# EAGLE design SensorBoard (EAGLE 6.6.0)
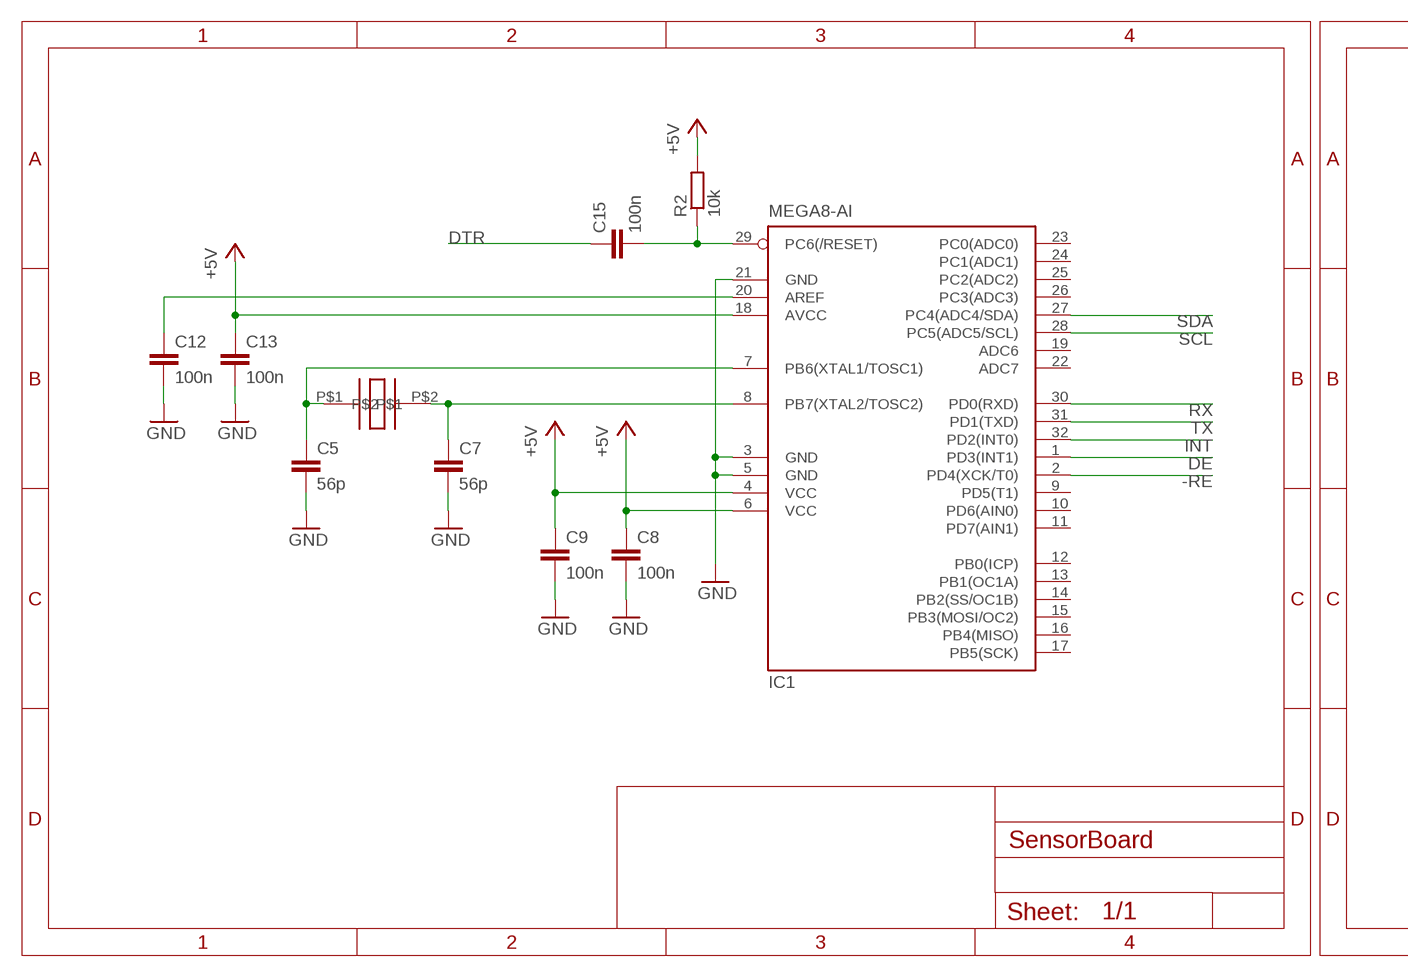
[diagram p0: schematic, sheet 1, part 1 of 2]
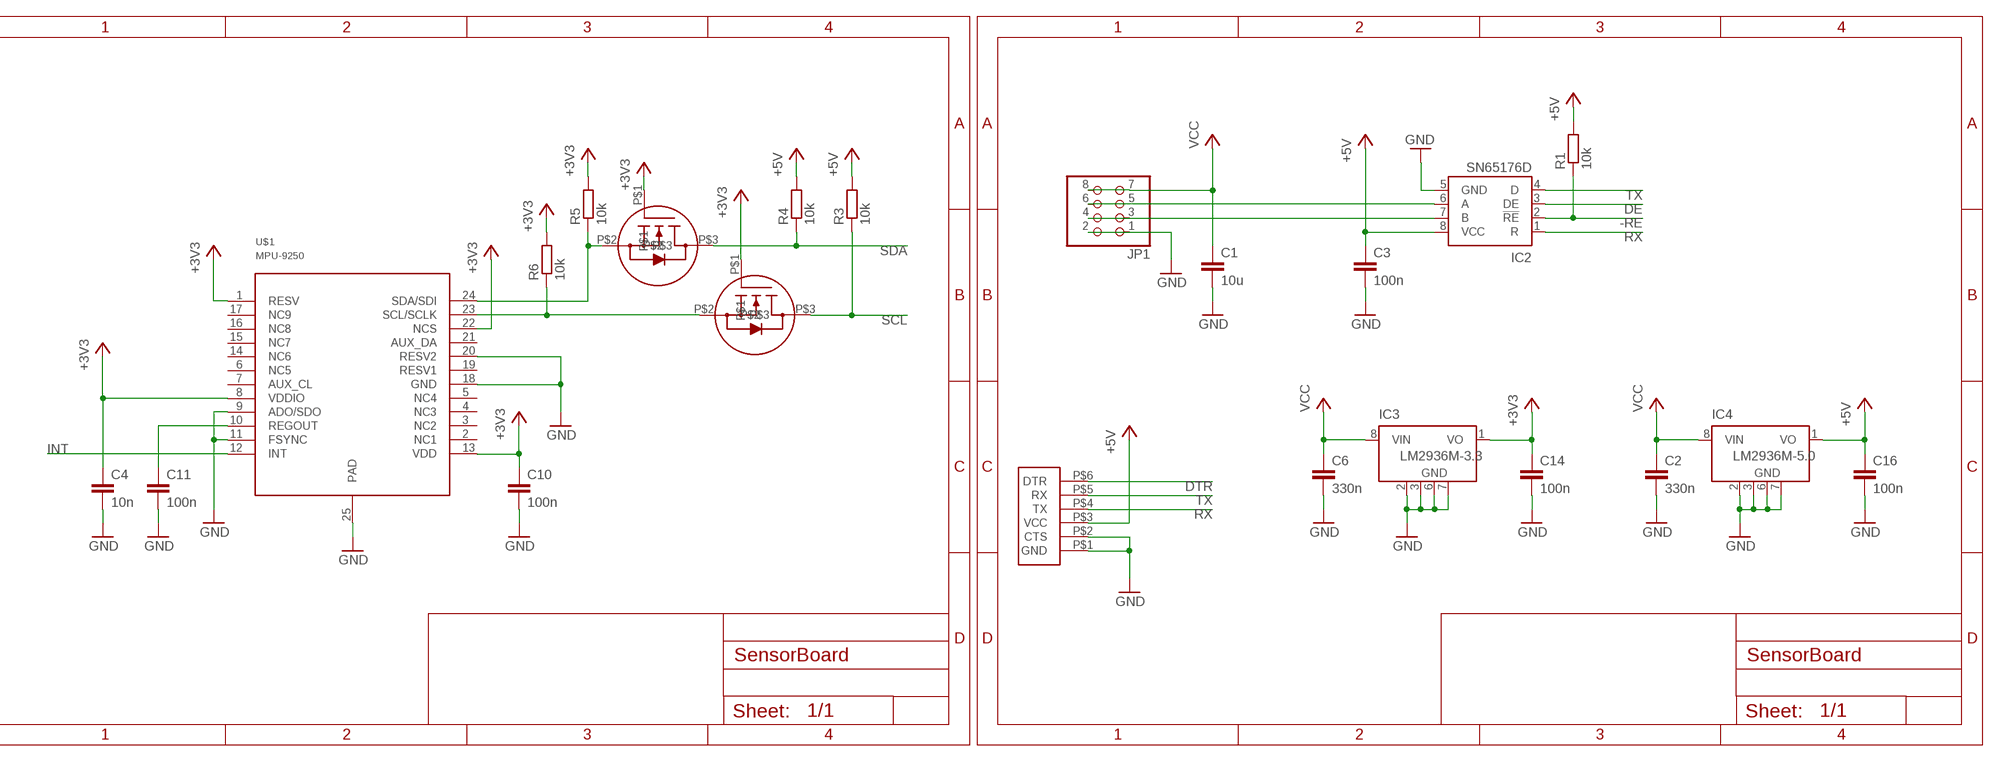
[diagram p1: schematic, sheet 1, part 2 of 2]

## Parts
C1  10u  C-EUC0805  [C0805]
C2  330n  C-EUC0603  [C0603]
C3  100n  C-EUC0603  [C0603]
C4  10n  C-EUC0603  [C0603]
C5  56p  C-EUC0603  [C0603]
C6  330n  C-EUC0603  [C0603]
C7  56p  C-EUC0603  [C0603]
C8  100n  C-EUC0603  [C0603]
C9  100n  C-EUC0603  [C0603]
C10  100n  C-EUC0603  [C0603]
C11  100n  C-EUC0603  [C0603]
C12  100n  C-EUC0603  [C0603]
C13  100n  C-EUC0603  [C0603]
C14  100n  C-EUC0603  [C0603]
C15  100n  C-EUC0603  [C0603]
C16  100n  C-EUC0603  [C0603]
IC1  MEGA8-AI  [TQFP32-08]
IC2  SN65176D  [SO-08]
IC3  LM2936M-3.3  [SO08]
IC4  LM2936M-5.0  [SO08]
JP1  PINHD-2X4/90  [2X04/90]
R1  10k  R-EU_R0603  [R0603]
R2  10k  R-EU_R0603  [R0603]
R3  10k  R-EU_R0603  [R0603]
R4  10k  R-EU_R0603  [R0603]
R5  10k  R-EU_R0603  [R0603]
R6  10k  R-EU_R0603  [R0603]
U$1  MPU-9250  [LEAD-QFN24]
U$2  2N7002E  [SOT-23-3]
U$3  2N7002E  [SOT-23-3]
U$4  LFXTAL003240BULK  [LFXTAL003240BULK]
U$5  FTDI-PINHEADER  [FTDI-PINHEADER]

## Nets
+3V3: C4.1 C10.1 C14.1 IC3.1(VO) R5.2 R6.2 U$1.1(RESV) U$1.8(VDDIO) U$1.13(VDD) U$1.22(NCS) U$2.P$1 U$3.P$1
+5V: C3.1 C8.1 C9.1 C13.1 C16.1 IC1.4(VCC) IC1.6(VCC) IC1.18(AVCC) IC2.8(VCC) IC4.1(VO) R1.2 R2.2 R3.2 R4.2 U$5.P$3(VCC)
-RE: IC1.2(PD4(XCK/T0)) IC2.2(!RE) R1.1
DE: IC1.1(PD3(INT1)) IC2.3(DE)
DTR: C15.1 U$5.P$6(DTR)
GND: C1.2 C2.2 C3.2 C4.2 C5.2 C6.2 C7.2 C8.2 C9.2 C10.2 C11.2 C12.2 C13.2 C14.2 C16.2 IC1.3(GND) IC1.5(GND) IC1.21(GND) IC2.5(GND) IC3.2(GND) IC3.3(GND) IC3.6(GND) IC3.7(GND) IC4.2(GND) IC4.3(GND) IC4.6(GND) IC4.7(GND) JP1.1 JP1.2 U$1.9(ADO/SDO) U$1.11(FSYNC) U$1.18(GND) U$1.20(RESV2) U$1.25(PAD) U$5.P$1(GND) U$5.P$2(CTS)
INT: IC1.32(PD2(INT0)) U$1.12(INT)
N$1: IC2.6(A) JP1.5 JP1.6
N$2: IC2.7(B) JP1.3 JP1.4
N$3: R6.1 U$1.23(SCL/SCLK) U$2.P$2
N$4: C11.1 U$1.10(REGOUT)
N$5: C5.1 IC1.7(PB6(XTAL1/TOSC1)) U$4.P$1
N$6: R5.1 U$1.24(SDA/SDI) U$3.P$2
N$7: C7.1 IC1.8(PB7(XTAL2/TOSC2)) U$4.P$2
N$8: C15.2 IC1.29(PC6(/RESET)) R2.1
N$9: C12.1 IC1.20(AREF)
RX: IC1.30(PD0(RXD)) IC2.1(R) U$5.P$4(TX)
SCL: IC1.28(PC5(ADC5/SCL)) R3.1 U$2.P$3
SDA: IC1.27(PC4(ADC4/SDA)) R4.1 U$3.P$3
TX: IC1.31(PD1(TXD)) IC2.4(D) U$5.P$5(RX)
VCC: C1.1 C2.1 C6.1 IC3.8(VIN) IC4.8(VIN) JP1.7 JP1.8
Unconnected: IC1.9(PD5(T1)) IC1.10(PD6(AIN0)) IC1.11(PD7(AIN1)) IC1.12(PB0(ICP)) IC1.13(PB1(OC1A)) IC1.14(PB2(SS/OC1B)) IC1.15(PB3(MOSI/OC2)) IC1.16(PB4(MISO)) IC1.17(PB5(SCK)) IC1.19(ADC6) IC1.22(ADC7) IC1.23(PC0(ADC0)) IC1.24(PC1(ADC1)) IC1.25(PC2(ADC2)) IC1.26(PC3(ADC3)) U$1.2(NC1) U$1.3(NC2) U$1.4(NC3) U$1.5(NC4) U$1.6(NC5) U$1.7(AUX_CL) U$1.14(NC6) U$1.15(NC7) U$1.16(NC8) U$1.17(NC9) U$1.19(RESV1) U$1.21(AUX_DA)

## Library data of the parts
C1-C16 = resistor:C-EU: CAPACITOR, European symbol
IC1 = atmel:MEGA8: MICROCONTROLLER 8 Kbytes FLASH, 1 kbytes SRAM, 512 bytes EEPROM, USART, 6-channel 10 bit ADC, 2-channel 8 bit ADC Pin compatible with Atmega48, ATMega88, ATMega168 Source: avr.lbr; MPN: ATMEGA8-16AU; OC_FARNELL: 9171371; OC_NEWARK: 73M8863
IC2 = texas:SN65176: DIFFERENTIAL BUS TRANSCEIVER Source: http://focus.ti.com .. sn65176b.pdf; MF: TEXAS INSTRUMENTS; MPN: SN65176BD; OC_FARNELL: 9589970; OC_NEWARK: 08F5891
IC3 = national-semiconductor:LM2936M?*: Ultra-Low Quiescent Current LDO Voltage Regulator Source: Data sheet <http://www.national.com/ds/LM/LM2936.pdf>; MF: NATIONAL SEMICONDUCTOR; MPN: LM2936M-3.3/NOPB; OC_FARNELL: 1469059; OC_NEWARK: 41K4514
IC4 = national-semiconductor:LM2936M?*: Ultra-Low Quiescent Current LDO Voltage Regulator Source: Data sheet <http://www.national.com/ds/LM/LM2936.pdf>; MF: NATIONAL SEMICONDUCTOR; MPN: LM2936M-5.0/NOPB; OC_FARNELL: 9494421; OC_NEWARK: 41K4515
JP1 = pinhead:PINHD-2X4: PIN HEADER
R1-R6 = resistor:R-EU_: RESISTOR, European symbol
U$1 = invensense:MPU-9250
U$2 U$3 = 2N7002E:2N7002E
U$4 = LFXTAL003240Bulk:LFXTAL003240BULK
U$5 = FTDI-PINHEADER:FTDI-PINHEADER

## Board
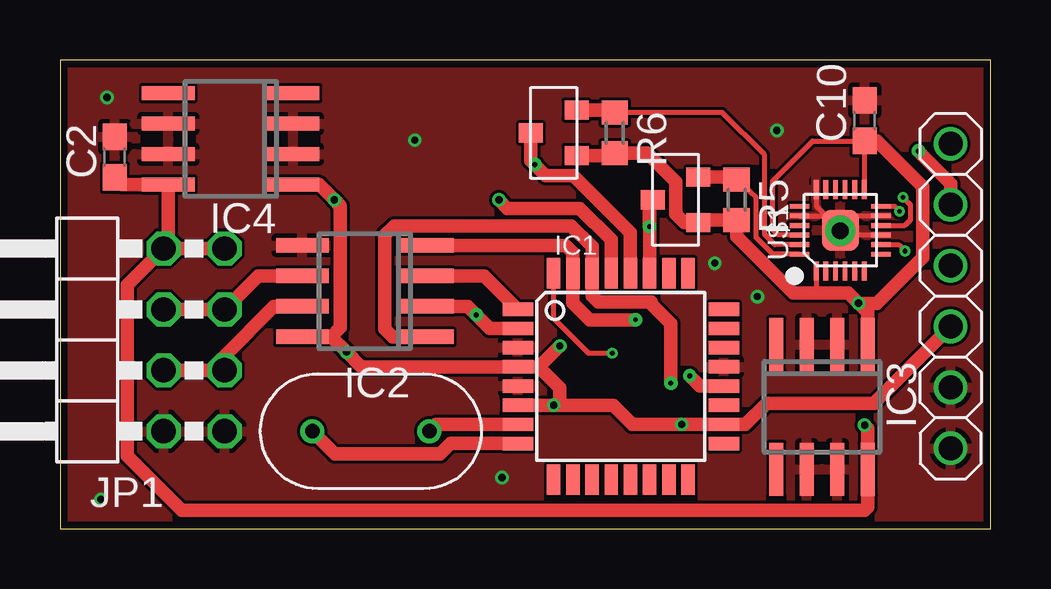
[diagram p2: board, top side]
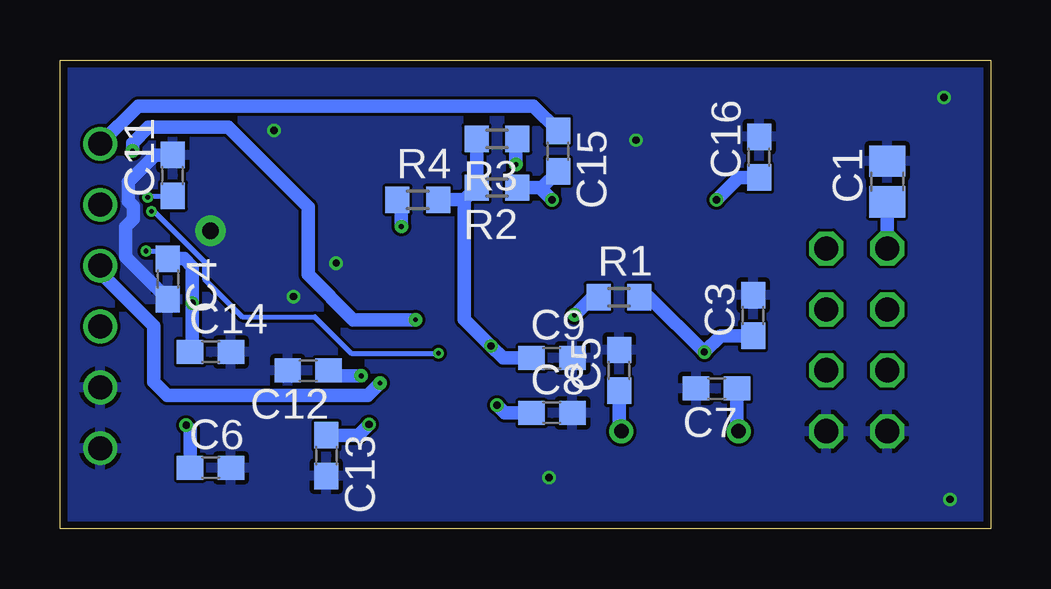
[diagram p3: board, bottom side, seen from below]

Size 38.79 x 19.55 mm. Coordinates in mm from the lower left corner, seen from the top.
Outline: 0,0 38.79,0 38.79,19.55 0,19.55 0,0
Copper layers (1*16): Top 0.035mm / dielectric 1.5mm / Bottom 0.035mm
Design rules "PCB-POOL HighSpec": minimum track width 0.125mm, minimum drill 0.2mm, track to track 0.125mm, track to pad 0.125mm, pad to pad 0.125mm, via to via 0.125mm, smd to smd 0.125mm, copper to edge 0.3mm, drill to drill 0.2mm, minimum pad ring 0.2mm, minimum via ring 0.125mm, stop-mask expansion 0.075mm, vias tented up to drill 0mil, thermal gap 0.2mm

### Footprints (pad centres in the part's own frame; a part is rotated, then mirrored left to right if it is on the bottom)
C0805 = smd 1.3 x 1.5: 1 -0.85,0; 2 0.85,0
C0603 = smd 1.1 x 1: 1 -0.85,0; 2 0.85,0
TQFP32-08 = smd 1.27 x 0.559: 1 -4.293,2.8; 2 -4.293,2; 3 -4.293,1.2; 4 -4.293,0.4; 5 -4.293,-0.4; 6 -4.293,-1.2; 7 -4.293,-2; 8 -4.293,-2.8; 17 4.293,-2.8; 18 4.293,-2; 19 4.293,-1.2; 20 4.293,-0.4; 21 4.293,0.4; 22 4.293,1.2; 23 4.293,2; 24 4.293,2.8 | smd 0.559 x 1.27: 9 -2.8,-4.293; 10 -2,-4.293; 11 -1.2,-4.293; 12 -0.4,-4.293; 13 0.4,-4.293; 14 1.2,-4.293; 15 2,-4.293; 16 2.8,-4.293; 25 2.8,4.293; 26 2,4.293; 27 1.2,4.293; 28 0.4,4.293; 29 -0.4,4.293; 30 -1.2,4.293; 31 -2,4.293; 32 -2.8,4.293
SO-08 = smd 0.6 x 2.2: 1 -1.905,-2.6; 2 -0.635,-2.6; 3 0.635,-2.6; 4 1.905,-2.6; 5 1.905,2.6; 6 0.635,2.6; 7 -0.635,2.6; 8 -1.905,2.6
SO08 = smd 0.6 x 2.2: 1 -1.905,-2.6; 2 -0.635,-2.6; 3 0.635,-2.6; 4 1.905,-2.6; 5 1.905,2.6; 6 0.635,2.6; 7 -0.635,2.6; 8 -1.905,2.6
2X04/90 = drill 1.016 octagon: 1 -3.81,-6.35; 2 -3.81,-3.81; 3 -1.27,-6.35; 4 -1.27,-3.81; 5 1.27,-6.35; 6 1.27,-3.81; 7 3.81,-6.35; 8 3.81,-3.81
R0603 = smd 1 x 1.1: 1 -0.85,0; 2 0.85,0
LEAD-QFN24 = smd 0.8 x 0.2: 1 -1.7,1; 2 -1.7,0.6; 3 -1.7,0.2; 4 -1.7,-0.2; 5 -1.7,-0.6; 6 -1.7,-1; 13 1.7,-1; 14 1.7,-0.6; 15 1.7,-0.2; 16 1.7,0.2; 17 1.7,0.6; 18 1.7,1 | smd 0.2 x 0.8: 7 -1,-1.7; 8 -0.6,-1.7; 9 -0.2,-1.7; 10 0.2,-1.7; 11 0.6,-1.7; 12 1,-1.7; 19 1,1.7; 20 0.6,1.7; 21 0.2,1.7; 22 -0.2,1.7; 23 -0.6,1.7; 24 -1,1.7 | smd 1.7 x 1.54: 25 0,0
SOT-23-3 = smd 0.8 x 1: P$1 -0.95,-0.95; P$2 0.95,-0.95; P$3 0,0.95
LFXTAL003240BULK = drill 0.6: P$1 -2.44,0; P$2 2.44,0
FTDI-PINHEADER = drill 1: P$1 0,-6.35; P$2 0,-3.81; P$3 0,-1.27; P$4 0,1.27; P$5 0,3.81; P$6 0,6.35

### Placement (x,y rotation side)
C1  4.32,14.48 90 bottom
C2  2.29,15.49 90 top
C3  9.91,8.89 90 bottom
C4  34.29,10.41 270 bottom
C5  15.49,6.6 90 bottom
C6  32.51,2.54 0 bottom
C7  11.43,5.84 180 bottom
C8  18.29,4.83 0 bottom
C9  18.29,7.11 0 bottom
C10  33.53,17.02 90 top
C11  34.09,14.73 90 bottom
C12  28.45,6.6 180 bottom
C13  27.69,3.05 270 bottom
C14  32.51,7.37 0 bottom
C15  18.03,15.75 270 bottom
C16  9.65,15.49 90 bottom
IC1  23.37,6.35 0 top
IC2  12.7,9.91 90 top
IC3  31.75,5.08 180 top
IC4  7.11,16.26 90 top
JP1  0.51,7.87 90 top
R1  15.49,9.65 0 bottom
R2  20.57,14.22 180 bottom
R3  20.57,16.26 180 bottom
R4  23.88,13.72 0 bottom
R5  28.19,13.72 270 top
R6  23.11,16.51 270 top
U$1  32.51,12.45 90 top
U$2  20.57,16.51 90 top
U$3  25.65,13.72 90 top
U$4  12.95,4.06 180 top
U$5  37.11,9.7 0 top

### Tracks (layer width: path | path; a pad name or v marks a point on that pad's centre or on a via)
+3V3  (via drill 0.2 pad 0.2, 0.3 pad 0.56)
  Top 0.2: 30.17,12.25 U$1.22 29.92,12.25 29.69,12.47 29.69,14.5 31.36,16.17 C10.1 33.51,16.15 U$1.13 | U$1.8 34.94,11.85 v35.2,11.58 | U$1.1 31.51,9.99 31.67,9.83
  Top 0.559: U$2.P$1 23.01,15.56 R6.2 24.47,15.66 25.65,14.48 25.65,13.12 26.01,12.77 U$3.P$1 26.7,12.87 R5.2 28.19,12.19 30.56,9.83 31.67,9.83 32.84,9.83 v33.27,9.4 | v33.27,9.4 33.66,9.02 IC3.1 | v33.27,9.4 34.04,9.4 35.94,11.3 35.94,14.28 34.05,16.17 C10.1
  Bottom 0.2: v35.2,11.58 34.61,11.58 C4.1
  Bottom 0.559: C14.1 33.27,7.45 v33.27,9.4 33.27,10.92 33.62,11.26 C4.1
+5V  (via drill 0.3 pad 0.56)
  Top 0.559: 11.3,8 v11.94,7.37 12.55,6.75 IC1.4 19.96,6.75 | 19.96,6.75 v20.83,7.62 | 19.96,6.75 20.83,5.88 20.83,5.33 20.64,5.15 IC1.6 v20.57,5.15 23.04,5.15 23.84,4.35 v25.91,4.35 IC1.18 28.56,4.35 29.44,5.23 33.91,5.23 U$5.P$3 | 11.3,8 11.68,8.38 11.68,13.46 v11.43,13.72 10.79,14.35 IC4.1 | 11.3,8 IC2.8
  Bottom 0.559: R4.2 21.93,13.72 | 21.93,13.72 R2.2 R3.2 | 21.93,13.72 21.93,8.72 v20.83,7.62 20.32,7.11 C9.1 | C3.1 11.26,8.04 v11.94,7.37 14.22,9.65 R1.2 | C8.1 20.25,4.83 v20.57,5.15 | C13.1 26.36,3.9 v25.91,4.35 | C16.1 10.5,14.64 v11.43,13.72
-RE  (via drill 0.2 pad 0.56)
  Top 0.559: IC2.2 16.99,9.27 v17.35,8.91 17.91,8.35 IC1.2
  Bottom 0.559: R1.1 16.61,9.65 v17.35,8.91
DE
  Top 0.559: IC2.3 17.68,10.54 IC1.1
DTR
  Bottom 0.559: C15.1 19.06,17.63 35.53,17.63 U$5.P$6
GND  (via drill 0.3 pad 0.56, 0.7 pad 0.2)
  Top 0.2: U$1.18 31.51,13.45 U$1.25 | U$1.20 31.91,13.05 U$1.25 | U$1.11 33.11,13.05 U$1.25 | U$1.9 32.71,12.25 U$1.25
  Bottom 0.559: C4.2 34.29,9.58 36.04,11.33 36.04,12.6 35.74,12.9 35.74,13.46 35.94,13.66 35.94,14.45 34.81,15.58 C11.2
  other vias: 29.06,9.68 27.28,11.07 18.41,2.13 14.78,16.21 29.87,16.61 1.7,1.22 1.96,17.98 32.51,12.42
  pour Bottom: 40.64,-1.27 -1.27,-1.27 -1.27,20.32 40.64,20.32
  pour Top: -2.54,21.59 -2.54,-2.54 41.91,-2.54 41.91,21.59
INT  (via drill 0.2 pad 0.2)
  Top 0.2: v23.01,7.32 22.02,7.32 20.57,8.77 IC1.32 | U$1.12 34.76,13.45 v34.98,13.23
  Bottom 0.2: v23.01,7.32 26.64,7.32 28.17,8.84 31.19,8.84 32.77,10.41 32.77,11.15 34.85,13.23 v34.98,13.23
N$1
  Top 0.559: JP1.6 JP1.5 8.26,10.54 IC2.6
N$2
  Top 0.559: JP1.4 JP1.3 6.86,7.21 8.91,9.27 IC2.7
N$3
  Top 0.2: U$1.23 29.79,11.85 29.36,12.27 29.36,15.6 27.6,17.36 R6.1
  Top 0.559: U$2.P$2 23.01,17.46 R6.1
N$4  (via drill 0.2 pad 0.2)
  Top 0.2: U$1.10 35.2,12.65 35.43,12.88 35.43,13.51 v35.13,13.82
  Bottom 0.2: C11.1 34.33,13.84 35.1,13.84 v35.13,13.82
N$5
  Top 0.559: IC1.7 15.68,4.35 U$4.P$1
  Bottom 0.559: C5.1 15.49,4.16 U$4.P$1
N$6
  Top 0.2: U$1.24 29.7,11.45 29.01,12.14 29.01,13.82 R5.1
  Top 0.559: U$3.P$2 28.09,14.67 R5.1
N$7
  Top 0.559: IC1.8 16.27,3.55 15.85,3.12 11.45,3.12 U$4.P$2
  Bottom 0.559: C7.1 10.58,4.13 U$4.P$2
N$8  (via drill 0.3 pad 0.56)
  Top 0.559: IC1.29 22.97,12.06 21.67,13.36 18.64,13.36 v18.29,13.72
  Bottom 0.559: R2.1 18.8,14.22 | 18.8,14.22 18.71,14.22 C15.2 | v18.29,13.72 18.8,14.22
N$9  (via drill 0.2 pad 0.56)
  Top 0.559: IC1.20 26.66,5.95 v26.24,6.38
  Bottom 0.559: v26.24,6.38 27.57,6.38 C12.1
RX  (via drill 0.2 pad 0.56)
  Top 0.559: IC2.1 13.87,8 13.54,8.33 13.54,12.24 13.92,12.62 21.31,12.62 22.17,11.77 IC1.30 22.17,9.71 22.43,9.45 24.56,9.45 | 24.56,9.45 24.64,9.45 | v25.45,6.07 25.45,8.56 24.56,9.45
  Bottom 0.559: v25.45,6.07 25.96,5.56 34.31,5.56 34.87,6.12 34.87,8.46 37.11,10.69 U$5.P$4
SCL  (via drill 0.2 pad 0.56)
  Top 0.559: IC1.28 23.77,12.35 21.39,14.73 20.24,14.73 v19.79,15.19 19.62,15.35 U$2.P$3
  Bottom 0.559: v19.79,15.19 19.79,16.19 R3.1
SDA  (via drill 0.2 pad 0.56)
  Top 0.559: IC1.27 24.57,13.58 U$3.P$3 24.56,13.57 v24.56,12.6
  Bottom 0.559: v24.56,12.6 24.56,13.55 R4.1
TX  (via drill 0.2 pad 0.56)
  Top 0.559: IC2.4 21.08,11.81 21.37,11.53 IC1.31 21.37,9.42 22.07,8.71 v23.98,8.71 | U$5.P$5 37.11,14.4 v35.76,15.75
  Bottom 0.559: v35.76,15.75 35.76,16.08 35.1,16.74 31.77,16.74 28.45,13.41 28.45,10.59 26.57,8.71 v23.98,8.71
VCC  (via drill 0.3 pad 0.56)
  Top 0.559: v33.53,4.32 33.66,4.19 IC3.8 33.66,0.89 33.53,0.76 5.08,0.76 2.79,3.05 2.79,10.16 JP1.8 | JP1.8 4.51,11.88 IC4.8 2.58,14.35 C2.1 | JP1.7 JP1.8
  Bottom 0.559: C6.1 33.36,4.15 v33.53,4.32 | C1.1 JP1.8